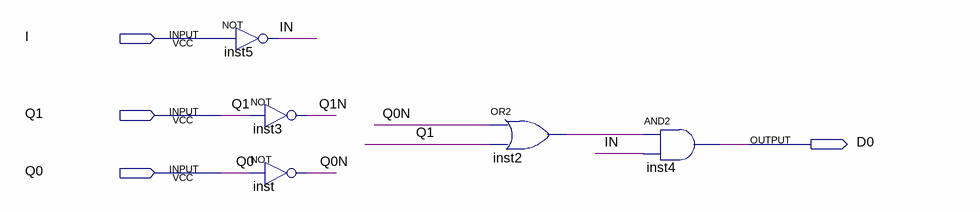
[diagram p0: schematic sheet]
// Quartus schematic D0.bdf as structural Verilog: 5 symbols, 4 pins
module D0 (
  input  I,
  input  Q1,
  input  Q0,
  output D0
);

  wire IN, inst2_out, Q0N, Q1N;

  not inst5 (IN, I);
  not inst3 (Q1N, Q1);
  not inst (Q0N, Q0);
  or inst2 (inst2_out, Q0N, Q1);
  and inst4 (D0, inst2_out, IN);
endmodule
